# EAGLE schematic BLEduino (EAGLE 6.5.0)
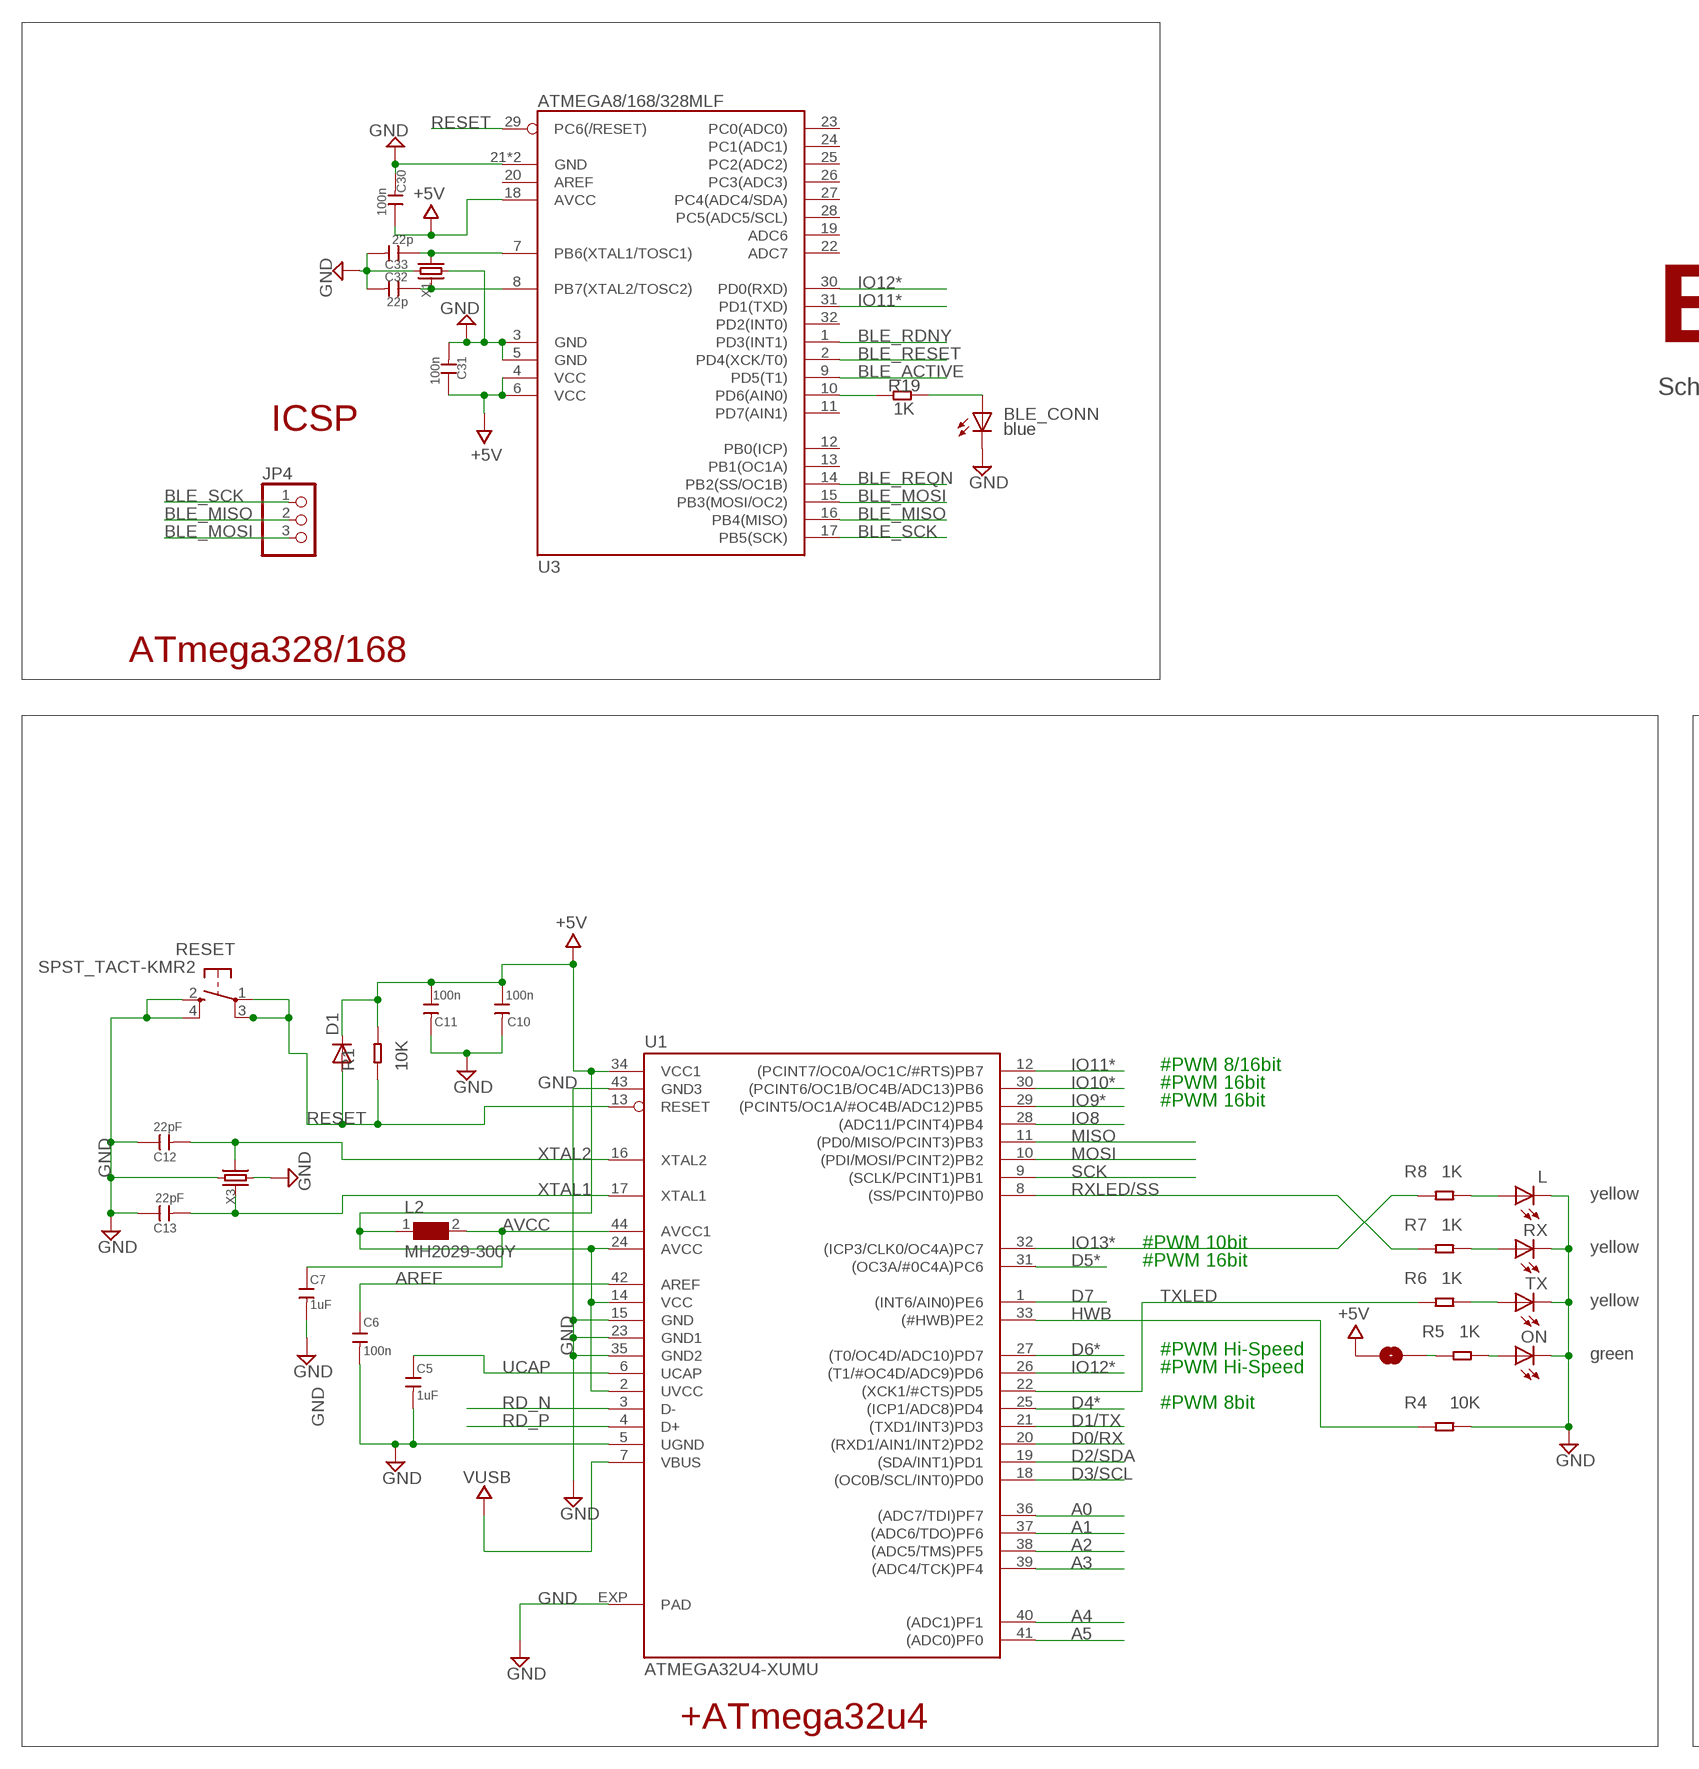
[diagram p0: schematic, sheet 1, part 1 of 2]
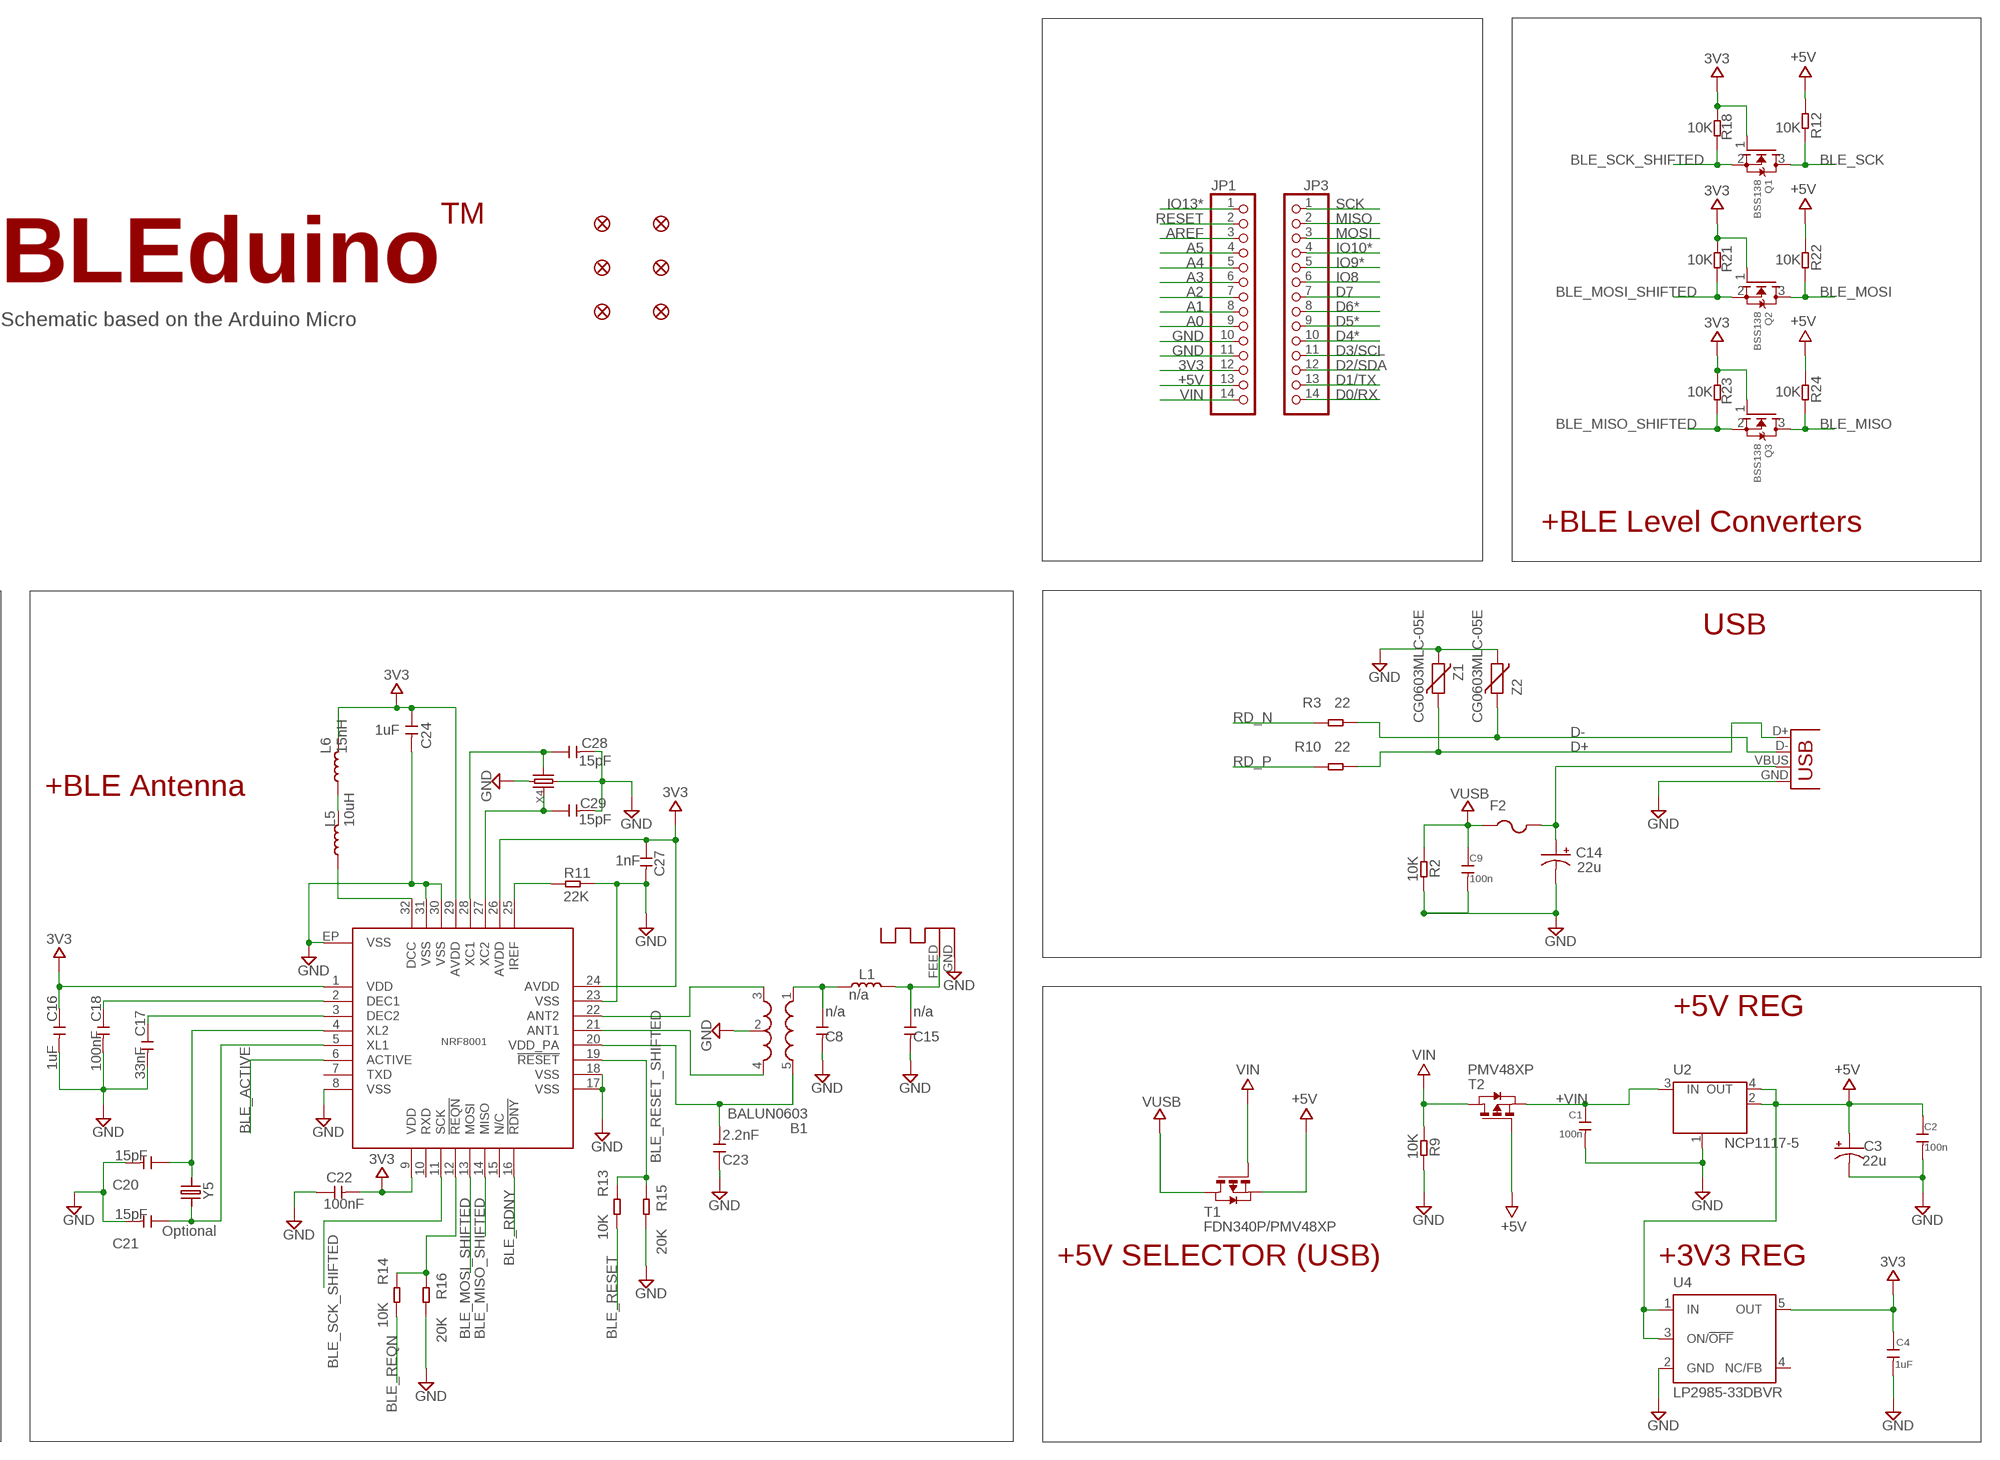
[diagram p1: schematic, sheet 1, part 2 of 2]

## Parts
ANT1  ANTENNA  [RN-ANT]
B1  BALUN0603  [BALUN-0603]
BLE_CONN  blue  LEDCHIP-LED0603  [CHIP-LED0603]
C1  100n  C-0402  [C0402]
C2  100n  C-0402  [C0402]
C3  22u  CAP_POL1206  [EIA3216]
C4  1uF  C-0402  [C0402]
C5  1uF  C-0402  [C0402]
C6  100n  C-0402  [C0402]
C7  1uF  C-0402  [C0402]
C8  n/a  C-0402  [C0402]
C9  100n  C-0402  [C0402]
C10  100n  C-0402  [C0402]
C11  100n  C-0402  [C0402]
C12  22pF  C-0402  [C0402]
C13  22pF  C-0402  [C0402]
C14  22u  CAP_POL1206  [EIA3216]
C15  n/a  C-0402  [C0402]
C16  1uF  C-0603  [C0603]
C17  33nF  C-0402  [C0402]
C18  100nF  C-0402  [C0402]
C20  15pF  C-0402  [C0402]
C21  15pF  C-0402  [C0402]
C22  100nF  C-0402  [C0402]
C23  2.2nF  C-0402  [C0402]
C24  1uF  C-0603  [C0603]
C27  1nF  C-0402  [C0402]
C28  15pF  C-0402  [C0402]
C29  15pF  C-0402  [C0402]
C30  100n  C-0402  [C0402]
C31  100n  C-0402  [C0402]
C32  22p  C-0402  [C0402]
C33  22p  C-0402  [C0402]
D1  DIODESOD  [SOD-323]
F2  PTCFUSE-1206  [R1206]
JP1  PINHD-1X14-CB  [1X14-CB]
JP2  FIDUCIALUFIDUCIAL  [MICRO-FIDUCIAL]
JP3  PINHD-1X14-CB  [1X14-CB]
JP4  PINHD-1X3CB  [1X03-CLEANBIG]
JP5  FIDUCIALUFIDUCIAL  [MICRO-FIDUCIAL]
JP6  FIDUCIALUFIDUCIAL  [MICRO-FIDUCIAL]
L  yellow  LEDCHIP-LED0603  [CHIP-LED0603]
L1  n/a  L'0402'  [L0402]
L2  MH2029-300Y  WE-CBF_0805  [0805]
L5  10uH  L'0603'  [L0603]
L6  15nH  L'0402'  [L0402]
NRF8001  FITNESSDEVICE_NRF8001  [FITNESSDEVICE_QFN-32]
ON  green  LEDCHIP-LED0603  [CHIP-LED0603]
Q1  BSS138  MOSFET-NREFLOW  [SOT23]
Q2  BSS138  MOSFET-NREFLOW  [SOT23]
Q3  BSS138  MOSFET-NREFLOW  [SOT23]
R1  10K  R-0402  [R0402]
R2  10K  R-0402  [R0402]
R3  22  R-0402  [R0402]
R4  10K  R-0402  [R0402]
R5  1K  R-0402  [R0402]
R6  1K  R-0402  [R0402]
R7  1K  R-0402  [R0402]
R8  1K  R-0402  [R0402]
R9  10K  R-0402  [R0402]
R10  22  R-0402  [R0402]
R11  22K  R-0402  [R0402]
R12  10K  R-0402  [R0402]
R13  10K  R-0402  [R0402]
R14  10K  R-0402  [R0402]
R15  20K  R-0402  [R0402]
R16  20K  R-0402  [R0402]
R18  10K  R-0402  [R0402]
R19  1K  R-0402  [R0402]
R21  10K  R-0402  [R0402]
R22  10K  R-0402  [R0402]
R23  10K  R-0402  [R0402]
R24  10K  R-0402  [R0402]
RESET  SPST_TACT-KMR2  [KMR2]
RX  yellow  LEDCHIP-LED0603  [CHIP-LED0603]
SJ1  SOLDERJUMPERNC2  [SJ_2S-NOTRACE]
T1  FDN340P/PMV48XP  PMOSSOT23  [SOT-23]
T2  PMV48XP  PMOSSOT23  [SOT-23]
TX  yellow  LEDCHIP-LED0603  [CHIP-LED0603]
U1  ATMEGA32U4-XUMU  [QFN44ML7X7]
U2  NCP1117-5  LINEAR_MC33269ST  [LINEAR_SOT223]
U3  ATMEGA8/168/328MLF  [MLF32X-W/HEAT]
U4  LP2985-33DBVR  LP2985-XXDBVR33  [SOT23-DBV]
U$28  FIDUCIAL1X2  [FIDUCIAL-1X2]
U$29  FIDUCIAL1X2  [FIDUCIAL-1X2]
U$53  FIDUCIAL1X2  [FIDUCIAL-1X2]
X1  CRYSTAL'3225'  [4P-SMD-3.2X2.5]
X2  SPARKFUN_USB-MICROB  [SPARKFUN_USB-MICROB]
X3  CRYSTAL'3225'  [4P-SMD-3.2X2.5]
X4  CRYSTAL'3225'  [4P-SMD-3.2X2.5]
Y5  Y5  FITNESSDEVICE_CRYSTAL-ABS10  [FITNESSDEVICE_CRYSTAL-ABS10]
Z1  CG0603MLC-05E  VARISTORCN0603  [CT/CN0603]
Z2  CG0603MLC-05E  VARISTORCN0603  [CT/CN0603]

## Nets
3V3: C4.1 C16.1 C22.2 C24.1 C27.1 JP1.12 L6.2 NRF8001.1(VDD) NRF8001.9(VDD) NRF8001.24(AVDD) NRF8001.26(AVDD) NRF8001.29(AVDD) Q1.1(G) Q2.1(G) Q3.1(G) R18.2 R21.2 R23.2 U4.5(OUT)
+5V: C2.1 C3.A(+) C10.1 C11.1 C30.1 C31.1 D1.1(C) JP1.13 L2.1 R1.1 R12.1 R22.1 R24.1 SJ1.1 T1.2(S) T2.3(G) U1.2(UVCC) U1.14(VCC) U1.24(AVCC) U1.34(VCC1) U2.2(OUT) U2.4(OUT) U3.4(VCC) U3.6(VCC) U3.18(AVCC) U4.1(IN) U4.3(ON/!OFF)
+VIN: C1.1 T2.2(S) U2.3(IN)
A0: JP1.9 U1.36((ADC7/TDI)PF7)
A1: JP1.8 U1.37((ADC6/TDO)PF6)
A2: JP1.7 U1.38((ADC5/TMS)PF5)
A3: JP1.6 U1.39((ADC4/TCK)PF4)
A4: JP1.5 U1.40((ADC1)PF1)
A5: JP1.4 U1.41((ADC0)PF0)
AREF: C6.1 JP1.3 U1.42(AREF)
AVCC: C7.1 L2.2 U1.44(AVCC1)
BLE_ACTIVE: NRF8001.6(ACTIVE) U3.9(PD5(T1))
BLE_MISO: JP4.2 Q3.3(D) R24.2 U3.16(PB4(MISO))
BLE_MISO_SHIFTED: NRF8001.14(MISO) Q3.2(S) R23.1
BLE_MOSI: JP4.3 Q2.3(D) R22.2 U3.15(PB3(MOSI/OC2))
BLE_MOSI_SHIFTED: NRF8001.13(MOSI) Q2.2(S) R21.1
BLE_RDNY: NRF8001.16(!RDNY) U3.1(PD3(INT1))
BLE_REQN: R14.1 U3.14(PB2(SS/OC1B))
BLE_REQN_SHIFTED: NRF8001.12(!REQN) R14.2 R16.2
BLE_RESET: R13.1 U3.2(PD4(XCK/T0))
BLE_RESET_SHIFTED: NRF8001.19(!RESET) R13.2 R15.2
BLE_SCK: JP4.1 Q1.3(D) R12.2 U3.17(PB5(SCK))
BLE_SCK_SHIFTED: NRF8001.11(SCK) Q1.2(S) R18.1
D0/RX: JP3.14 U1.20((RXD1/AIN1/INT2)PD2)
D1/TX: JP3.13 U1.21((TXD1/INT3)PD3)
D2/SDA: JP3.12 U1.19((SDA/INT1)PD1)
D3/SCL: JP3.11 U1.18((OC0B/SCL/INT0)PD0)
D4*: JP3.10 U1.25((ICP1/ADC8)PD4)
D5*: JP3.9 U1.31((OC3A/#0C4A)PC6)
D6*: JP3.8 U1.27((T0/OC4D/ADC10)PD7)
D7: JP3.7 U1.1((INT6/AIN0)PE6)
D+: R10.2 X2.D+ Z1.1
D-: R3.2 X2.D- Z2.1
GND: ANT1.GND B1.2(GND) BLE_CONN.C C1.2 C2.2 C3.C(-) C4.2 C5.2 C6.2 C7.2 C8.2 C9.2 C10.2 C11.2 C12.1 C13.1 C14.C(-) C15.2 C16.2 C17.2 C18.2 C20.2 C21.2 C22.1 C23.1 C24.2 C27.2 C28.2 C29.2 C30.2 C31.2 C32.2 C33.2 JP1.10 JP1.11 L.C NRF8001.8(VSS) NRF8001.17(VSS) NRF8001.18(VSS) NRF8001.23(VSS) NRF8001.30(VSS) NRF8001.31(VSS) NRF8001.EP(VSS) ON.C R2.1 R4.2 R9.1 R11.2 R15.1 R16.1 RESET.2(S) RESET.4(S1) RX.C TX.C U1.5(UGND) U1.15(GND) U1.23(GND1) U1.35(GND2) U1.43(GND3) U1.EXP(PAD) U2.1(GND/ADJ) U3.3(GND) U3.5(GND) U3.21(GND) U3.HEAT(GND) U4.2(GND) X1.1(GND_TOP) X1.3(GND_BOTTOM) X2.GND X3.1(GND_TOP) X3.3(GND_BOTTOM) X4.1(GND_TOP) X4.3(GND_BOTTOM) Z1.2 Z2.2
HWB: R4.1 U1.33((#HWB)PE2)
IO8: JP3.6 U1.28((ADC11/PCINT4)PB4)
IO9*: JP3.5 U1.29((PCINT5/OC1A/#OC4B/ADC12)PB5)
IO10*: JP3.4 U1.30((PCINT6/OC1B/OC4B/ADC13)PB6)
IO11*: U1.12((PCINT7/OC0A/OC1C/#RTS)PB7) U3.31(PD1(TXD))
IO12*: U1.26((T1/#OC4D/ADC9)PD6) U3.30(PD0(RXD))
IO13*: JP1.1 R8.1 U1.32((ICP3/CLK0/OC4A)PC7)
MISO: JP3.2 U1.11((PD0/MISO/PCINT3)PB3)
MOSI: JP3.3 U1.10((PDI/MOSI/PCINT2)PB2)
N$1: C33.1 U3.7(PB6(XTAL1/TOSC1)) X1.4
N$2: R7.2 RX.A
N$3: ON.A R5.2
N$4: R6.2 TX.A
N$5: C32.1 U3.8(PB7(XTAL2/TOSC2)) X1.2
N$6: R19.2 U3.10(PD6(AIN0))
N$7: L.A R8.2
N$8: BLE_CONN.A R19.1
N$9: ANT1.FEED C15.1 L1.2
N$13: C18.1 NRF8001.2(DEC1)
N$14: R5.1 SJ1.2
N$15: L5.1 NRF8001.32(DCC)
N$17: L5.2 L6.1
N$18: C17.1 NRF8001.3(DEC2)
N$19: C20.1 NRF8001.4(XL2) Y5.P$1
N$20: C21.1 NRF8001.5(XL1) Y5.P$2
N$23: B1.5(GND) C23.2 NRF8001.20(VDD_PA)
N$24: B1.3(OUT1) NRF8001.22(ANT2)
N$25: B1.4(OUT2) NRF8001.21(ANT1)
N$26: B1.1(IN) C8.1 L1.1
N$28: NRF8001.25(IREF) R11.1
N$29: C28.1 NRF8001.28(XC1) X4.4
N$30: C29.1 NRF8001.27(XC2) X4.2
RD_N: R3.1 U1.3(D-)
RD_P: R10.1 U1.4(D+)
RESET: D1.2(A) JP1.2 R1.2 RESET.1(P) RESET.3(P1) U1.13(RESET) U3.29(PC6(/RESET))
RXLED/SS: R7.1 U1.8((SS/PCINT0)PB0)
SCK: JP3.1 U1.9((SCLK/PCINT1)PB1)
TXLED: R6.1 U1.22((XCK1/#CTS)PD5)
UCAP: C5.1 U1.6(UCAP)
VIN: JP1.14 R9.2 T1.3(G) T2.1(D)
VUSB: C9.1 F2.1 R2.2 T1.1(D) U1.7(VBUS)
VUSBD: C14.A(+) F2.2 X2.VBUS
XTAL1: C13.2 U1.17(XTAL1) X3.2
XTAL2: C12.2 U1.16(XTAL2) X3.4
Unconnected: NRF8001.7(TXD) NRF8001.10(RXD) NRF8001.15(N/C) U3.11(PD7(AIN1)) U3.12(PB0(ICP)) U3.13(PB1(OC1A)) U3.19(ADC6) U3.20(AREF) U3.22(ADC7) U3.23(PC0(ADC0)) U3.24(PC1(ADC1)) U3.25(PC2(ADC2)) U3.26(PC3(ADC3)) U3.27(PC4(ADC4/SDA)) U3.28(PC5(ADC5/SCL)) U3.32(PD2(INT0)) U4.4(NC/FB)

## Notes on the sheet
- TM
- BLEduino
- Schematic based on the Arduino Micro
- ICSP
- +BLE Level Converters
- ATmega328/168
- USB
- +BLE Antenna
- #PWM 8/16bit
- #PWM 16bit
- #PWM 16bit
- +5V REG
- #PWM 10bit
- #PWM 16bit
- #PWM Hi-Speed
- #PWM Hi-Speed
- #PWM 8bit
- Optional
- +5V SELECTOR (USB) | +3V3 REG
- +ATmega32u4

## Library data of the parts
ANT1 = adafruit:ANTENNA
B1 = SparkFun:BALUN
BLE_CONN L ON RX TX = adafruit:LED: LED OSRAM: - CHIPLED LG R971, LG N971, LY N971, LG Q971, LY Q971, LO R971, LY R971 LH N974, LH R974 LS Q976, LO Q976, LY Q976 LO Q996 - Hyper CHIPLED LW Q18S LB Q993, LB Q99A, LB R99A - SideLED LS A670, LO A670, LY A670, LG A670, LP A670 LB A673, LV A673, LT A673, LW A673 LH A674 LY A675 LS A676, LA A676, LO A676, LY A676, LW A676 LS A679, LY A679, LG A679 - Hyper Micro SIDELED® LS Y876, LA Y876, LO Y876, LY Y876 LT Y87S - SmartLED LW L88C, LW L88S LB L89C, LB L89S, LG L890 LS L89K, LO L89K, LY L89K LS L896, LA L896, LO L896, LY L896 - TOPLED LS T670, LO T670, LY T670, LG T670, LP T670 LSG T670, LSP T670, LSY T670, LOP T670, LYG T670 LG T671, LOG T671, LSG T671 LB T673, LV T673, LT T673, LW T673 LH T674 LS T676, LA T676, LO T676, LY T676, LB T676, LH T676, LSB T676, LW T676 LB T67C, LV T67C, LT T67C, LS T67K, LO T67K, LY T67K, LW E67C LS E67B, LA E67B, LO E67B, LY E67B, LB E67C, LV E67C, LT E67C LW T67C LS T679, LY T679, LG T679 LS T770, LO T770, LY T770, LG T770, LP T770 LB T773, LV T773, LT T773, LW T773 LH T774 LS E675, LA E675, LY E675, LS T675 LS T776, LA T776, LO T776, LY T776, LB T776 LHGB T686 LT T68C, LB T68C - Hyper Mini TOPLED® LB M676 - Mini TOPLED Santana® LG M470 LS M47K, LO M47K, LY M47K Source: http://www.osram.convergy.de/
C1 C2 C4-C13 C15-C18 C20-C24 C27-C33 = Discrete:C*: Ceramic Capacitors
C3 C14 = SparkFun:CAP_POL: Capacitor Polarized These are standard SMD and PTH capacitors. Normally 10uF, 47uF, and 100uF in electrolytic and tantalum varieties. Always verify the external diameter of the through hole cap, it varies with capacity, voltage, and manufacturer. The EIA devices should be standard.
D1 = SparkFun:DIODE: Diode These are standard reverse protection diodes and small signal diodes. SMA package can handle up to about 1A. SOD-323 can handle about 200mA. What the SOD-323 package when ordering, there are some mfgs out there that are 5-pin packages.
F2 = adafruit:PTCFUSE: PTC fuses, resettable thermistors
JP1 JP3 = adafruit:PINHD-1X14: PIN HEADER
JP2 JP5 JP6 U$28 U$29 U$53 = SparkFun:FIDUCIAL: Fiducial Alignment Points Various fiducial points for machine vision alignment.
JP4 = adafruit:PINHD-1X3: PIN HEADER
L1 L5 L6 = Discrete:L*
L2 = Wuerth_Elektronik_eiSos_V6:WE-CBF: SMD EMI Suppression Ferrite Beads WE-CBF - Excellent anti-EMI properties - Low DC-restistance - Impedances till 3000 ohms - Rated current up to 6 A -- Reliable Ni-Sn electrodes -- Perfect as data lined filter and for uncoupling of distribution voltage
NRF8001 = bluetooth:FITNESSDEVICE_NRF8001: nRF8001 is a Bluetooth® low energy solution designed for operation in the peripheral role. By integrating a Bluetooth low energy compliant radio (PHY), slave mode link controller and host, nRF8001 offers you an easy way to add Bluetooth low energy connectivity to your application.
Q1-Q3 = adafruit:MOSFET-N: N-Channel Mosfet 2N7002E - 60V 260mA SOT23 [Digikey: 2N7002ET1GOSTR-ND] - REEL BSH103 - 30V 850mA SOT23 [Digikey: 568-5013-1-ND]
R1-R16 R18 R19 R21-R24 = Discrete:R*
RESET = adafruit:SPST_TACT: SMT 6mm switch, EVQQ2 series http://www.ladyada.net/library/eagle
SJ1 = SparkFun:SOLDERJUMPER: Solder Jumper Standard SMD solder jumper. Used to automate production. Two varients : Normally Open and Normally Closed are the same, but have different paste layers. NC will have a large amount of paste and should jumper during reflow.
T1 T2 = zetex:PMOSSOT23: MOS FET
U1 = SmartPrj:ATMEGA32U4-XU
U2 = SmartPrj:LINEAR_MC33269ST*: Adjustable Output Low Dropout Voltage Regulator 800 mA Source: http://www.onsemi.com/pub/Collateral/MC33269-D.PDF
U3 = IC:ATMEGA8/168/328: MICROCONTROLLER
U4 = SmartPrj:LP2985-XXDBVR: ULTRALOW-POWER 50-mA LOW-DROPOUT LINEAR REGULATORS 50-mA Low-Dropout Regulator Source: http://focus.ti.com/lit/ds/symlink/tps77001.pdf
X1 X3 X4 = Discrete:CRYSTAL*: CRYSTAL
X2 = Micro_USB:SPARKFUN_USB: USB Connectors USB-B-PTH is fully proven SKU : PRT-00139 USB-miniB is fully proven SKU : PRT-00587 USB-A-PCB is untested. USB-A-H is throughly reviewed, but untested. Spark Fun Electronics SKU : PRT-00437 USB-B-SMT is throughly reviewed, but untested. Needs silkscreen touching up. USB-A-S has not been used/tested USB-MB-H has not been used/tested
Y5 = bluetooth:FITNESSDEVICE_CRYSTAL-ABS10: ABS10-32.768KHZ-9-T
Z1 Z2 = varistor:VARISTOR: VARISTOR

## Net classes
0 default: width 0.203 mm